# Vivado block design bd_f519, xcku15p-ffve1517-3-e, Vivado 2024.2
# (continued, part 3 of 3)
current_bd_instance /m05_nodes

# ---- hierarchy /m05_exit_pipeline ----
current_bd_instance /m05_exit_pipeline
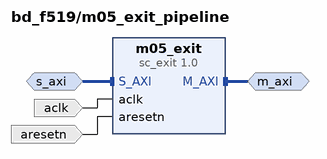
[diagram p17: block diagram inside /m05_exit_pipeline]
create_bd_intf_pin -mode Slave -vlnv xilinx.com:interface:aximm_rtl:1.0 s_axi
create_bd_intf_pin -mode Master -vlnv xilinx.com:interface:aximm_rtl:1.0 m_axi
create_bd_pin -dir I -type clk aclk
create_bd_pin -dir I -type rst aresetn

create_bd_cell -type ip -vlnv xilinx.com:ip:sc_exit:1.0 m05_exit
set_property -dict [list \
  CONFIG.ADDR_WIDTH 8 \
  CONFIG.ENABLE_PIPELINING 0 \
  CONFIG.HAS_BURST 0 \
  CONFIG.IS_CASCADED 0 \
  CONFIG.MEP_IDENTIFIER_WIDTH 1 \
  CONFIG.M_MAX_BURST_LENGTH 0 \
  CONFIG.M_PROTOCOL AXI4LITE \
  CONFIG.NUM_MSC 6 \
  CONFIG.NUM_READ_OUTSTANDING 8 \
  CONFIG.NUM_WRITE_OUTSTANDING 32 \
  CONFIG.RDATA_WIDTH 32 \
  CONFIG.READ_WRITE_MODE READ_WRITE \
  CONFIG.SINGLE_ISSUING 1 \
  CONFIG.SSC000_ROUTE 0b101 \
  CONFIG.SSC001_ROUTE 0b111 \
  CONFIG.SSC_ROUTE_WIDTH 3 \
  CONFIG.S_ID_WIDTH 1 \
  CONFIG.WDATA_WIDTH 32 \
] [get_bd_cells m05_exit]

# ---- connections ----

current_bd_instance /clk_map
connect_bd_net -net clk_map_aclk1_net [get_bd_pins aclk1] \
  [get_bd_pins M02_ACLK] [get_bd_pins psr0/slowest_sync_clk] [get_bd_pins psr_aclk1/slowest_sync_clk]
connect_bd_net -net clk_map_aclk2_net [get_bd_pins aclk2] \
  [get_bd_pins M03_ACLK] [get_bd_pins M04_ACLK] [get_bd_pins M05_ACLK] [get_bd_pins psr_aclk2/slowest_sync_clk]
connect_bd_net -net clk_map_aclk_net [get_bd_pins aclk] \
  [get_bd_pins S00_ACLK] [get_bd_pins M00_ACLK] [get_bd_pins M01_ACLK] [get_bd_pins swbd_aclk] \
  [get_bd_pins psr_aclk/slowest_sync_clk]
connect_bd_net -net clk_map_aresetn_net [get_bd_pins aresetn] \
  [get_bd_pins psr0/aux_reset_in] [get_bd_pins psr_aclk/aux_reset_in] [get_bd_pins psr_aclk1/aux_reset_in] \
  [get_bd_pins psr_aclk2/aux_reset_in]
connect_bd_net [get_bd_pins one/dout] [get_bd_pins psr0/ext_reset_in]
connect_bd_net [get_bd_pins psr0/interconnect_aresetn] \
  [get_bd_pins psr_aclk/ext_reset_in] [get_bd_pins psr_aclk1/ext_reset_in] [get_bd_pins psr_aclk2/ext_reset_in]
connect_bd_net [get_bd_pins psr_aclk1/interconnect_aresetn] [get_bd_pins M02_ARESETN]
connect_bd_net [get_bd_pins psr_aclk2/interconnect_aresetn] [get_bd_pins M03_ARESETN] [get_bd_pins M04_ARESETN] [get_bd_pins M05_ARESETN]
connect_bd_net [get_bd_pins psr_aclk/interconnect_aresetn] \
  [get_bd_pins S00_ARESETN] [get_bd_pins M00_ARESETN] [get_bd_pins M01_ARESETN] [get_bd_pins swbd_aresetn]

current_bd_instance /switchboards
connect_bd_intf_net [get_bd_intf_pins S00_SC_AR] [get_bd_intf_pins ar_la_in_swbd/S00_SC]
connect_bd_intf_net [get_bd_intf_pins S00_SC_AW] [get_bd_intf_pins aw_la_in_swbd/S00_SC]
connect_bd_intf_net [get_bd_intf_pins S00_SC_B] [get_bd_intf_pins b_la_out_swbd/S00_SC]
connect_bd_intf_net [get_bd_intf_pins S00_SC_R] [get_bd_intf_pins r_la_out_swbd/S00_SC]
connect_bd_intf_net [get_bd_intf_pins S00_SC_W] [get_bd_intf_pins w_la_in_swbd/S00_SC]
connect_bd_intf_net [get_bd_intf_pins S01_SC_B] [get_bd_intf_pins b_la_out_swbd/S01_SC]
connect_bd_intf_net [get_bd_intf_pins S01_SC_R] [get_bd_intf_pins r_la_out_swbd/S01_SC]
connect_bd_intf_net [get_bd_intf_pins S02_SC_B] [get_bd_intf_pins b_la_out_swbd/S02_SC]
connect_bd_intf_net [get_bd_intf_pins S02_SC_R] [get_bd_intf_pins r_la_out_swbd/S02_SC]
connect_bd_intf_net [get_bd_intf_pins S03_SC_B] [get_bd_intf_pins b_la_out_swbd/S03_SC]
connect_bd_intf_net [get_bd_intf_pins S03_SC_R] [get_bd_intf_pins r_la_out_swbd/S03_SC]
connect_bd_intf_net [get_bd_intf_pins S04_SC_B] [get_bd_intf_pins b_la_out_swbd/S04_SC]
connect_bd_intf_net [get_bd_intf_pins S04_SC_R] [get_bd_intf_pins r_la_out_swbd/S04_SC]
connect_bd_intf_net [get_bd_intf_pins S05_SC_B] [get_bd_intf_pins b_la_out_swbd/S05_SC]
connect_bd_intf_net [get_bd_intf_pins S05_SC_R] [get_bd_intf_pins r_la_out_swbd/S05_SC]
connect_bd_intf_net [get_bd_intf_pins ar_la_in_swbd/M00_SC] [get_bd_intf_pins i_nodes/S_SC_AR]
connect_bd_intf_net [get_bd_intf_pins M00_SC_AR] [get_bd_intf_pins ar_la_out_swbd/M00_SC]
connect_bd_intf_net [get_bd_intf_pins M01_SC_AR] [get_bd_intf_pins ar_la_out_swbd/M01_SC]
connect_bd_intf_net [get_bd_intf_pins M02_SC_AR] [get_bd_intf_pins ar_la_out_swbd/M02_SC]
connect_bd_intf_net [get_bd_intf_pins M03_SC_AR] [get_bd_intf_pins ar_la_out_swbd/M03_SC]
connect_bd_intf_net [get_bd_intf_pins M04_SC_AR] [get_bd_intf_pins ar_la_out_swbd/M04_SC]
connect_bd_intf_net [get_bd_intf_pins M05_SC_AR] [get_bd_intf_pins ar_la_out_swbd/M05_SC]
connect_bd_intf_net [get_bd_intf_pins aw_la_in_swbd/M00_SC] [get_bd_intf_pins i_nodes/S_SC_AW]
connect_bd_intf_net [get_bd_intf_pins M00_SC_AW] [get_bd_intf_pins aw_la_out_swbd/M00_SC]
connect_bd_intf_net [get_bd_intf_pins M01_SC_AW] [get_bd_intf_pins aw_la_out_swbd/M01_SC]
connect_bd_intf_net [get_bd_intf_pins M02_SC_AW] [get_bd_intf_pins aw_la_out_swbd/M02_SC]
connect_bd_intf_net [get_bd_intf_pins M03_SC_AW] [get_bd_intf_pins aw_la_out_swbd/M03_SC]
connect_bd_intf_net [get_bd_intf_pins M04_SC_AW] [get_bd_intf_pins aw_la_out_swbd/M04_SC]
connect_bd_intf_net [get_bd_intf_pins M05_SC_AW] [get_bd_intf_pins aw_la_out_swbd/M05_SC]
connect_bd_intf_net [get_bd_intf_pins M00_SC_B] [get_bd_intf_pins b_la_in_swbd/M00_SC]
connect_bd_intf_net [get_bd_intf_pins b_la_out_swbd/M00_SC] [get_bd_intf_pins i_nodes/S_SC_B]
connect_bd_intf_net [get_bd_intf_pins ar_la_out_swbd/S00_SC] [get_bd_intf_pins i_nodes/M_SC_AR]
connect_bd_intf_net [get_bd_intf_pins aw_la_out_swbd/S00_SC] [get_bd_intf_pins i_nodes/M_SC_AW]
connect_bd_intf_net [get_bd_intf_pins b_la_in_swbd/S00_SC] [get_bd_intf_pins i_nodes/M_SC_B]
connect_bd_intf_net [get_bd_intf_pins r_la_in_swbd/S00_SC] [get_bd_intf_pins i_nodes/M_SC_R]
connect_bd_intf_net [get_bd_intf_pins w_la_out_swbd/S00_SC] [get_bd_intf_pins i_nodes/M_SC_W]
connect_bd_intf_net [get_bd_intf_pins M00_SC_R] [get_bd_intf_pins r_la_in_swbd/M00_SC]
connect_bd_intf_net [get_bd_intf_pins r_la_out_swbd/M00_SC] [get_bd_intf_pins i_nodes/S_SC_R]
connect_bd_intf_net [get_bd_intf_pins w_la_in_swbd/M00_SC] [get_bd_intf_pins i_nodes/S_SC_W]
connect_bd_intf_net [get_bd_intf_pins M00_SC_W] [get_bd_intf_pins w_la_out_swbd/M00_SC]
connect_bd_intf_net [get_bd_intf_pins M01_SC_W] [get_bd_intf_pins w_la_out_swbd/M01_SC]
connect_bd_intf_net [get_bd_intf_pins M02_SC_W] [get_bd_intf_pins w_la_out_swbd/M02_SC]
connect_bd_intf_net [get_bd_intf_pins M03_SC_W] [get_bd_intf_pins w_la_out_swbd/M03_SC]
connect_bd_intf_net [get_bd_intf_pins M04_SC_W] [get_bd_intf_pins w_la_out_swbd/M04_SC]
connect_bd_intf_net [get_bd_intf_pins M05_SC_W] [get_bd_intf_pins w_la_out_swbd/M05_SC]
connect_bd_net [get_bd_pins m_sc_aclk] \
  [get_bd_pins i_nodes/m_sc_aclk] [get_bd_pins ar_la_out_swbd/aclk] [get_bd_pins aw_la_out_swbd/aclk] \
  [get_bd_pins b_la_out_swbd/aclk] [get_bd_pins r_la_out_swbd/aclk] [get_bd_pins w_la_out_swbd/aclk]
connect_bd_net [get_bd_pins m_sc_aresetn] [get_bd_pins i_nodes/m_sc_aresetn]
connect_bd_net [get_bd_pins s_sc_aclk] \
  [get_bd_pins i_nodes/s_sc_aclk] [get_bd_pins ar_la_in_swbd/aclk] [get_bd_pins aw_la_in_swbd/aclk] \
  [get_bd_pins b_la_in_swbd/aclk] [get_bd_pins r_la_in_swbd/aclk] [get_bd_pins w_la_in_swbd/aclk]
connect_bd_net [get_bd_pins s_sc_aresetn] [get_bd_pins i_nodes/s_sc_aresetn]

current_bd_instance /switchboards/i_nodes
connect_bd_intf_net [get_bd_intf_pins S_SC_AR] [get_bd_intf_pins i_ar_node/S_SC]
connect_bd_intf_net [get_bd_intf_pins S_SC_AW] [get_bd_intf_pins i_aw_node/S_SC]
connect_bd_intf_net [get_bd_intf_pins S_SC_B] [get_bd_intf_pins i_b_node/S_SC]
connect_bd_intf_net [get_bd_intf_pins S_SC_R] [get_bd_intf_pins i_r_node/S_SC]
connect_bd_intf_net [get_bd_intf_pins S_SC_W] [get_bd_intf_pins i_w_node/S_SC]
connect_bd_intf_net [get_bd_intf_pins M_SC_AR] [get_bd_intf_pins i_ar_node/M_SC]
connect_bd_intf_net [get_bd_intf_pins M_SC_AW] [get_bd_intf_pins i_aw_node/M_SC]
connect_bd_intf_net [get_bd_intf_pins M_SC_B] [get_bd_intf_pins i_b_node/M_SC]
connect_bd_intf_net [get_bd_intf_pins M_SC_R] [get_bd_intf_pins i_r_node/M_SC]
connect_bd_intf_net [get_bd_intf_pins M_SC_W] [get_bd_intf_pins i_w_node/M_SC]
connect_bd_net [get_bd_pins m_sc_aclk] \
  [get_bd_pins i_aw_node/m_sc_aclk] [get_bd_pins i_ar_node/m_sc_aclk] [get_bd_pins i_w_node/m_sc_aclk] \
  [get_bd_pins i_r_node/s_sc_aclk] [get_bd_pins i_b_node/s_sc_aclk]
connect_bd_net [get_bd_pins m_sc_aresetn] \
  [get_bd_pins i_aw_node/m_sc_aresetn] [get_bd_pins i_ar_node/m_sc_aresetn] [get_bd_pins i_w_node/m_sc_aresetn] \
  [get_bd_pins i_r_node/s_sc_aresetn] [get_bd_pins i_b_node/s_sc_aresetn]
connect_bd_net [get_bd_pins s_sc_aclk] \
  [get_bd_pins i_aw_node/s_sc_aclk] [get_bd_pins i_w_node/s_sc_aclk] [get_bd_pins i_ar_node/s_sc_aclk] \
  [get_bd_pins i_r_node/m_sc_aclk] [get_bd_pins i_b_node/m_sc_aclk]
connect_bd_net [get_bd_pins s_sc_aresetn] \
  [get_bd_pins i_aw_node/s_sc_aresetn] [get_bd_pins i_w_node/s_sc_aresetn] [get_bd_pins i_ar_node/s_sc_aresetn] \
  [get_bd_pins i_r_node/m_sc_aresetn] [get_bd_pins i_b_node/m_sc_aresetn]

current_bd_instance /s00_entry_pipeline
connect_bd_intf_net [get_bd_intf_pins s00_mmu/M_AXI] [get_bd_intf_pins s00_transaction_regulator/S_AXI]
connect_bd_intf_net [get_bd_intf_pins m_axi] [get_bd_intf_pins s00_si_converter/M_AXI]
connect_bd_intf_net [get_bd_intf_pins s00_transaction_regulator/M_AXI] [get_bd_intf_pins s00_si_converter/S_AXI]
connect_bd_intf_net [get_bd_intf_pins s_axi] [get_bd_intf_pins s00_mmu/S_AXI]
connect_bd_net [get_bd_pins aclk] [get_bd_pins s00_mmu/aclk] [get_bd_pins s00_si_converter/aclk] [get_bd_pins s00_transaction_regulator/aclk]
connect_bd_net [get_bd_pins aresetn] \
  [get_bd_pins s00_mmu/aresetn] [get_bd_pins s00_si_converter/aresetn] [get_bd_pins s00_transaction_regulator/aresetn]

current_bd_instance /s00_nodes
connect_bd_intf_net [get_bd_intf_pins S_SC_AR] [get_bd_intf_pins s00_ar_node/S_SC]
connect_bd_intf_net [get_bd_intf_pins S_SC_AW] [get_bd_intf_pins s00_aw_node/S_SC]
connect_bd_intf_net [get_bd_intf_pins S_SC_B] [get_bd_intf_pins s00_b_node/S_SC]
connect_bd_intf_net [get_bd_intf_pins S_SC_R] [get_bd_intf_pins s00_r_node/S_SC]
connect_bd_intf_net [get_bd_intf_pins S_SC_W] [get_bd_intf_pins s00_w_node/S_SC]
connect_bd_intf_net [get_bd_intf_pins M_SC_AR] [get_bd_intf_pins s00_ar_node/M_SC]
connect_bd_intf_net [get_bd_intf_pins M_SC_AW] [get_bd_intf_pins s00_aw_node/M_SC]
connect_bd_intf_net [get_bd_intf_pins M_SC_B] [get_bd_intf_pins s00_b_node/M_SC]
connect_bd_intf_net [get_bd_intf_pins M_SC_R] [get_bd_intf_pins s00_r_node/M_SC]
connect_bd_intf_net [get_bd_intf_pins M_SC_W] [get_bd_intf_pins s00_w_node/M_SC]
connect_bd_net [get_bd_pins m_sc_clk] \
  [get_bd_pins s00_ar_node/m_sc_aclk] [get_bd_pins s00_aw_node/m_sc_aclk] [get_bd_pins s00_w_node/m_sc_aclk] \
  [get_bd_pins s00_r_node/s_sc_aclk] [get_bd_pins s00_b_node/s_sc_aclk]
connect_bd_net [get_bd_pins m_sc_resetn] \
  [get_bd_pins s00_ar_node/m_sc_aresetn] [get_bd_pins s00_aw_node/m_sc_aresetn] [get_bd_pins s00_w_node/m_sc_aresetn] \
  [get_bd_pins s00_r_node/s_sc_aresetn] [get_bd_pins s00_b_node/s_sc_aresetn]
connect_bd_net [get_bd_pins s_sc_clk] \
  [get_bd_pins s00_ar_node/s_sc_aclk] [get_bd_pins s00_aw_node/s_sc_aclk] [get_bd_pins s00_w_node/s_sc_aclk] \
  [get_bd_pins s00_r_node/m_sc_aclk] [get_bd_pins s00_b_node/m_sc_aclk]
connect_bd_net [get_bd_pins s_sc_resetn] \
  [get_bd_pins s00_ar_node/s_sc_aresetn] [get_bd_pins s00_aw_node/s_sc_aresetn] [get_bd_pins s00_w_node/s_sc_aresetn] \
  [get_bd_pins s00_r_node/m_sc_aresetn] [get_bd_pins s00_b_node/m_sc_aresetn]

current_bd_instance /m00_nodes
connect_bd_intf_net [get_bd_intf_pins S_SC_AR] [get_bd_intf_pins m00_ar_node/S_SC]
connect_bd_intf_net [get_bd_intf_pins S_SC_AW] [get_bd_intf_pins m00_aw_node/S_SC]
connect_bd_intf_net [get_bd_intf_pins S_SC_B] [get_bd_intf_pins m00_b_node/S_SC]
connect_bd_intf_net [get_bd_intf_pins S_SC_R] [get_bd_intf_pins m00_r_node/S_SC]
connect_bd_intf_net [get_bd_intf_pins S_SC_W] [get_bd_intf_pins m00_w_node/S_SC]
connect_bd_intf_net [get_bd_intf_pins M_SC_AR] [get_bd_intf_pins m00_ar_node/M_SC]
connect_bd_intf_net [get_bd_intf_pins M_SC_AW] [get_bd_intf_pins m00_aw_node/M_SC]
connect_bd_intf_net [get_bd_intf_pins M_SC_B] [get_bd_intf_pins m00_b_node/M_SC]
connect_bd_intf_net [get_bd_intf_pins M_SC_R] [get_bd_intf_pins m00_r_node/M_SC]
connect_bd_intf_net [get_bd_intf_pins M_SC_W] [get_bd_intf_pins m00_w_node/M_SC]
connect_bd_net [get_bd_pins m_axi_aclk] \
  [get_bd_pins m00_ar_node/m_sc_aclk] [get_bd_pins m00_aw_node/m_sc_aclk] [get_bd_pins m00_w_node/m_sc_aclk] \
  [get_bd_pins m00_r_node/s_sc_aclk] [get_bd_pins m00_b_node/s_sc_aclk]
connect_bd_net [get_bd_pins m_axi_aresetn] \
  [get_bd_pins m00_ar_node/m_sc_aresetn] [get_bd_pins m00_aw_node/m_sc_aresetn] [get_bd_pins m00_w_node/m_sc_aresetn] \
  [get_bd_pins m00_r_node/s_sc_aresetn] [get_bd_pins m00_b_node/s_sc_aresetn]
connect_bd_net [get_bd_pins s_axi_aclk] \
  [get_bd_pins m00_ar_node/s_sc_aclk] [get_bd_pins m00_aw_node/s_sc_aclk] [get_bd_pins m00_w_node/s_sc_aclk] \
  [get_bd_pins m00_r_node/m_sc_aclk] [get_bd_pins m00_b_node/m_sc_aclk]
connect_bd_net [get_bd_pins s_axi_aresetn] \
  [get_bd_pins m00_ar_node/s_sc_aresetn] [get_bd_pins m00_aw_node/s_sc_aresetn] [get_bd_pins m00_w_node/s_sc_aresetn] \
  [get_bd_pins m00_r_node/m_sc_aresetn] [get_bd_pins m00_b_node/m_sc_aresetn]

current_bd_instance /m00_exit_pipeline
connect_bd_intf_net [get_bd_intf_pins m_axi] [get_bd_intf_pins m00_exit/M_AXI]
connect_bd_intf_net [get_bd_intf_pins s_axi] [get_bd_intf_pins m00_exit/S_AXI]
connect_bd_net [get_bd_pins aclk] [get_bd_pins m00_exit/aclk]
connect_bd_net [get_bd_pins aresetn] [get_bd_pins m00_exit/aresetn]

current_bd_instance /m01_nodes
connect_bd_intf_net [get_bd_intf_pins S_SC_AR] [get_bd_intf_pins m01_ar_node/S_SC]
connect_bd_intf_net [get_bd_intf_pins S_SC_AW] [get_bd_intf_pins m01_aw_node/S_SC]
connect_bd_intf_net [get_bd_intf_pins S_SC_B] [get_bd_intf_pins m01_b_node/S_SC]
connect_bd_intf_net [get_bd_intf_pins S_SC_R] [get_bd_intf_pins m01_r_node/S_SC]
connect_bd_intf_net [get_bd_intf_pins S_SC_W] [get_bd_intf_pins m01_w_node/S_SC]
connect_bd_intf_net [get_bd_intf_pins M_SC_AR] [get_bd_intf_pins m01_ar_node/M_SC]
connect_bd_intf_net [get_bd_intf_pins M_SC_AW] [get_bd_intf_pins m01_aw_node/M_SC]
connect_bd_intf_net [get_bd_intf_pins M_SC_B] [get_bd_intf_pins m01_b_node/M_SC]
connect_bd_intf_net [get_bd_intf_pins M_SC_R] [get_bd_intf_pins m01_r_node/M_SC]
connect_bd_intf_net [get_bd_intf_pins M_SC_W] [get_bd_intf_pins m01_w_node/M_SC]
connect_bd_net [get_bd_pins m_axi_aclk] \
  [get_bd_pins m01_ar_node/m_sc_aclk] [get_bd_pins m01_aw_node/m_sc_aclk] [get_bd_pins m01_w_node/m_sc_aclk] \
  [get_bd_pins m01_r_node/s_sc_aclk] [get_bd_pins m01_b_node/s_sc_aclk]
connect_bd_net [get_bd_pins m_axi_aresetn] \
  [get_bd_pins m01_ar_node/m_sc_aresetn] [get_bd_pins m01_aw_node/m_sc_aresetn] [get_bd_pins m01_w_node/m_sc_aresetn] \
  [get_bd_pins m01_r_node/s_sc_aresetn] [get_bd_pins m01_b_node/s_sc_aresetn]
connect_bd_net [get_bd_pins s_axi_aclk] \
  [get_bd_pins m01_ar_node/s_sc_aclk] [get_bd_pins m01_aw_node/s_sc_aclk] [get_bd_pins m01_w_node/s_sc_aclk] \
  [get_bd_pins m01_r_node/m_sc_aclk] [get_bd_pins m01_b_node/m_sc_aclk]
connect_bd_net [get_bd_pins s_axi_aresetn] \
  [get_bd_pins m01_ar_node/s_sc_aresetn] [get_bd_pins m01_aw_node/s_sc_aresetn] [get_bd_pins m01_w_node/s_sc_aresetn] \
  [get_bd_pins m01_r_node/m_sc_aresetn] [get_bd_pins m01_b_node/m_sc_aresetn]

current_bd_instance /m01_exit_pipeline
connect_bd_intf_net [get_bd_intf_pins m_axi] [get_bd_intf_pins m01_exit/M_AXI]
connect_bd_intf_net [get_bd_intf_pins s_axi] [get_bd_intf_pins m01_exit/S_AXI]
connect_bd_net [get_bd_pins aclk] [get_bd_pins m01_exit/aclk]
connect_bd_net [get_bd_pins aresetn] [get_bd_pins m01_exit/aresetn]

current_bd_instance /m02_nodes
connect_bd_intf_net [get_bd_intf_pins S_SC_AR] [get_bd_intf_pins m02_ar_node/S_SC]
connect_bd_intf_net [get_bd_intf_pins S_SC_AW] [get_bd_intf_pins m02_aw_node/S_SC]
connect_bd_intf_net [get_bd_intf_pins S_SC_B] [get_bd_intf_pins m02_b_node/S_SC]
connect_bd_intf_net [get_bd_intf_pins S_SC_R] [get_bd_intf_pins m02_r_node/S_SC]
connect_bd_intf_net [get_bd_intf_pins S_SC_W] [get_bd_intf_pins m02_w_node/S_SC]
connect_bd_intf_net [get_bd_intf_pins M_SC_AR] [get_bd_intf_pins m02_ar_node/M_SC]
connect_bd_intf_net [get_bd_intf_pins M_SC_AW] [get_bd_intf_pins m02_aw_node/M_SC]
connect_bd_intf_net [get_bd_intf_pins M_SC_B] [get_bd_intf_pins m02_b_node/M_SC]
connect_bd_intf_net [get_bd_intf_pins M_SC_R] [get_bd_intf_pins m02_r_node/M_SC]
connect_bd_intf_net [get_bd_intf_pins M_SC_W] [get_bd_intf_pins m02_w_node/M_SC]
connect_bd_net [get_bd_pins m_axi_aclk] \
  [get_bd_pins m02_ar_node/m_sc_aclk] [get_bd_pins m02_aw_node/m_sc_aclk] [get_bd_pins m02_w_node/m_sc_aclk] \
  [get_bd_pins m02_r_node/s_sc_aclk] [get_bd_pins m02_b_node/s_sc_aclk]
connect_bd_net [get_bd_pins m_axi_aresetn] \
  [get_bd_pins m02_ar_node/m_sc_aresetn] [get_bd_pins m02_aw_node/m_sc_aresetn] [get_bd_pins m02_w_node/m_sc_aresetn] \
  [get_bd_pins m02_r_node/s_sc_aresetn] [get_bd_pins m02_b_node/s_sc_aresetn]
connect_bd_net [get_bd_pins s_axi_aclk] \
  [get_bd_pins m02_ar_node/s_sc_aclk] [get_bd_pins m02_aw_node/s_sc_aclk] [get_bd_pins m02_w_node/s_sc_aclk] \
  [get_bd_pins m02_r_node/m_sc_aclk] [get_bd_pins m02_b_node/m_sc_aclk]
connect_bd_net [get_bd_pins s_axi_aresetn] \
  [get_bd_pins m02_ar_node/s_sc_aresetn] [get_bd_pins m02_aw_node/s_sc_aresetn] [get_bd_pins m02_w_node/s_sc_aresetn] \
  [get_bd_pins m02_r_node/m_sc_aresetn] [get_bd_pins m02_b_node/m_sc_aresetn]

current_bd_instance /m02_exit_pipeline
connect_bd_intf_net [get_bd_intf_pins m_axi] [get_bd_intf_pins m02_exit/M_AXI]
connect_bd_intf_net [get_bd_intf_pins s_axi] [get_bd_intf_pins m02_exit/S_AXI]
connect_bd_net [get_bd_pins aclk] [get_bd_pins m02_exit/aclk]
connect_bd_net [get_bd_pins aresetn] [get_bd_pins m02_exit/aresetn]

current_bd_instance /m03_nodes
connect_bd_intf_net [get_bd_intf_pins S_SC_AR] [get_bd_intf_pins m03_ar_node/S_SC]
connect_bd_intf_net [get_bd_intf_pins S_SC_AW] [get_bd_intf_pins m03_aw_node/S_SC]
connect_bd_intf_net [get_bd_intf_pins S_SC_B] [get_bd_intf_pins m03_b_node/S_SC]
connect_bd_intf_net [get_bd_intf_pins S_SC_R] [get_bd_intf_pins m03_r_node/S_SC]
connect_bd_intf_net [get_bd_intf_pins S_SC_W] [get_bd_intf_pins m03_w_node/S_SC]
connect_bd_intf_net [get_bd_intf_pins M_SC_AR] [get_bd_intf_pins m03_ar_node/M_SC]
connect_bd_intf_net [get_bd_intf_pins M_SC_AW] [get_bd_intf_pins m03_aw_node/M_SC]
connect_bd_intf_net [get_bd_intf_pins M_SC_B] [get_bd_intf_pins m03_b_node/M_SC]
connect_bd_intf_net [get_bd_intf_pins M_SC_R] [get_bd_intf_pins m03_r_node/M_SC]
connect_bd_intf_net [get_bd_intf_pins M_SC_W] [get_bd_intf_pins m03_w_node/M_SC]
connect_bd_net [get_bd_pins m_axi_aclk] \
  [get_bd_pins m03_ar_node/m_sc_aclk] [get_bd_pins m03_aw_node/m_sc_aclk] [get_bd_pins m03_w_node/m_sc_aclk] \
  [get_bd_pins m03_r_node/s_sc_aclk] [get_bd_pins m03_b_node/s_sc_aclk]
connect_bd_net [get_bd_pins m_axi_aresetn] \
  [get_bd_pins m03_ar_node/m_sc_aresetn] [get_bd_pins m03_aw_node/m_sc_aresetn] [get_bd_pins m03_w_node/m_sc_aresetn] \
  [get_bd_pins m03_r_node/s_sc_aresetn] [get_bd_pins m03_b_node/s_sc_aresetn]
connect_bd_net [get_bd_pins s_axi_aclk] \
  [get_bd_pins m03_ar_node/s_sc_aclk] [get_bd_pins m03_aw_node/s_sc_aclk] [get_bd_pins m03_w_node/s_sc_aclk] \
  [get_bd_pins m03_r_node/m_sc_aclk] [get_bd_pins m03_b_node/m_sc_aclk]
connect_bd_net [get_bd_pins s_axi_aresetn] \
  [get_bd_pins m03_ar_node/s_sc_aresetn] [get_bd_pins m03_aw_node/s_sc_aresetn] [get_bd_pins m03_w_node/s_sc_aresetn] \
  [get_bd_pins m03_r_node/m_sc_aresetn] [get_bd_pins m03_b_node/m_sc_aresetn]

current_bd_instance /m03_exit_pipeline
connect_bd_intf_net [get_bd_intf_pins m_axi] [get_bd_intf_pins m03_exit/M_AXI]
connect_bd_intf_net [get_bd_intf_pins s_axi] [get_bd_intf_pins m03_exit/S_AXI]
connect_bd_net [get_bd_pins aclk] [get_bd_pins m03_exit/aclk]
connect_bd_net [get_bd_pins aresetn] [get_bd_pins m03_exit/aresetn]

current_bd_instance /m04_nodes
connect_bd_intf_net [get_bd_intf_pins S_SC_AR] [get_bd_intf_pins m04_ar_node/S_SC]
connect_bd_intf_net [get_bd_intf_pins S_SC_AW] [get_bd_intf_pins m04_aw_node/S_SC]
connect_bd_intf_net [get_bd_intf_pins S_SC_B] [get_bd_intf_pins m04_b_node/S_SC]
connect_bd_intf_net [get_bd_intf_pins S_SC_R] [get_bd_intf_pins m04_r_node/S_SC]
connect_bd_intf_net [get_bd_intf_pins S_SC_W] [get_bd_intf_pins m04_w_node/S_SC]
connect_bd_intf_net [get_bd_intf_pins M_SC_AR] [get_bd_intf_pins m04_ar_node/M_SC]
connect_bd_intf_net [get_bd_intf_pins M_SC_AW] [get_bd_intf_pins m04_aw_node/M_SC]
connect_bd_intf_net [get_bd_intf_pins M_SC_B] [get_bd_intf_pins m04_b_node/M_SC]
connect_bd_intf_net [get_bd_intf_pins M_SC_R] [get_bd_intf_pins m04_r_node/M_SC]
connect_bd_intf_net [get_bd_intf_pins M_SC_W] [get_bd_intf_pins m04_w_node/M_SC]
connect_bd_net [get_bd_pins m_axi_aclk] \
  [get_bd_pins m04_ar_node/m_sc_aclk] [get_bd_pins m04_aw_node/m_sc_aclk] [get_bd_pins m04_w_node/m_sc_aclk] \
  [get_bd_pins m04_r_node/s_sc_aclk] [get_bd_pins m04_b_node/s_sc_aclk]
connect_bd_net [get_bd_pins m_axi_aresetn] \
  [get_bd_pins m04_ar_node/m_sc_aresetn] [get_bd_pins m04_aw_node/m_sc_aresetn] [get_bd_pins m04_w_node/m_sc_aresetn] \
  [get_bd_pins m04_r_node/s_sc_aresetn] [get_bd_pins m04_b_node/s_sc_aresetn]
connect_bd_net [get_bd_pins s_axi_aclk] \
  [get_bd_pins m04_ar_node/s_sc_aclk] [get_bd_pins m04_aw_node/s_sc_aclk] [get_bd_pins m04_w_node/s_sc_aclk] \
  [get_bd_pins m04_r_node/m_sc_aclk] [get_bd_pins m04_b_node/m_sc_aclk]
connect_bd_net [get_bd_pins s_axi_aresetn] \
  [get_bd_pins m04_ar_node/s_sc_aresetn] [get_bd_pins m04_aw_node/s_sc_aresetn] [get_bd_pins m04_w_node/s_sc_aresetn] \
  [get_bd_pins m04_r_node/m_sc_aresetn] [get_bd_pins m04_b_node/m_sc_aresetn]

current_bd_instance /m04_exit_pipeline
connect_bd_intf_net [get_bd_intf_pins m_axi] [get_bd_intf_pins m04_exit/M_AXI]
connect_bd_intf_net [get_bd_intf_pins s_axi] [get_bd_intf_pins m04_exit/S_AXI]
connect_bd_net [get_bd_pins aclk] [get_bd_pins m04_exit/aclk]
connect_bd_net [get_bd_pins aresetn] [get_bd_pins m04_exit/aresetn]

current_bd_instance /m05_nodes
connect_bd_intf_net [get_bd_intf_pins S_SC_AR] [get_bd_intf_pins m05_ar_node/S_SC]
connect_bd_intf_net [get_bd_intf_pins S_SC_AW] [get_bd_intf_pins m05_aw_node/S_SC]
connect_bd_intf_net [get_bd_intf_pins S_SC_B] [get_bd_intf_pins m05_b_node/S_SC]
connect_bd_intf_net [get_bd_intf_pins S_SC_R] [get_bd_intf_pins m05_r_node/S_SC]
connect_bd_intf_net [get_bd_intf_pins S_SC_W] [get_bd_intf_pins m05_w_node/S_SC]
connect_bd_intf_net [get_bd_intf_pins M_SC_AR] [get_bd_intf_pins m05_ar_node/M_SC]
connect_bd_intf_net [get_bd_intf_pins M_SC_AW] [get_bd_intf_pins m05_aw_node/M_SC]
connect_bd_intf_net [get_bd_intf_pins M_SC_B] [get_bd_intf_pins m05_b_node/M_SC]
connect_bd_intf_net [get_bd_intf_pins M_SC_R] [get_bd_intf_pins m05_r_node/M_SC]
connect_bd_intf_net [get_bd_intf_pins M_SC_W] [get_bd_intf_pins m05_w_node/M_SC]
connect_bd_net [get_bd_pins m_axi_aclk] \
  [get_bd_pins m05_ar_node/m_sc_aclk] [get_bd_pins m05_aw_node/m_sc_aclk] [get_bd_pins m05_w_node/m_sc_aclk] \
  [get_bd_pins m05_r_node/s_sc_aclk] [get_bd_pins m05_b_node/s_sc_aclk]
connect_bd_net [get_bd_pins m_axi_aresetn] \
  [get_bd_pins m05_ar_node/m_sc_aresetn] [get_bd_pins m05_aw_node/m_sc_aresetn] [get_bd_pins m05_w_node/m_sc_aresetn] \
  [get_bd_pins m05_r_node/s_sc_aresetn] [get_bd_pins m05_b_node/s_sc_aresetn]
connect_bd_net [get_bd_pins s_axi_aclk] \
  [get_bd_pins m05_ar_node/s_sc_aclk] [get_bd_pins m05_aw_node/s_sc_aclk] [get_bd_pins m05_w_node/s_sc_aclk] \
  [get_bd_pins m05_r_node/m_sc_aclk] [get_bd_pins m05_b_node/m_sc_aclk]
connect_bd_net [get_bd_pins s_axi_aresetn] \
  [get_bd_pins m05_ar_node/s_sc_aresetn] [get_bd_pins m05_aw_node/s_sc_aresetn] [get_bd_pins m05_w_node/s_sc_aresetn] \
  [get_bd_pins m05_r_node/m_sc_aresetn] [get_bd_pins m05_b_node/m_sc_aresetn]

current_bd_instance /m05_exit_pipeline
connect_bd_intf_net [get_bd_intf_pins m_axi] [get_bd_intf_pins m05_exit/M_AXI]
connect_bd_intf_net [get_bd_intf_pins s_axi] [get_bd_intf_pins m05_exit/S_AXI]
connect_bd_net [get_bd_pins aclk] [get_bd_pins m05_exit/aclk]
connect_bd_net [get_bd_pins aresetn] [get_bd_pins m05_exit/aresetn]

current_bd_instance /
connect_bd_intf_net [get_bd_intf_ports S00_AXI] [get_bd_intf_pins s00_entry_pipeline/s_axi]
connect_bd_intf_net [get_bd_intf_pins s00_nodes/S_SC_AR] [get_bd_intf_pins s00_axi2sc/M_SC_AR]
connect_bd_intf_net [get_bd_intf_pins m00_nodes/S_SC_AR] [get_bd_intf_pins switchboards/M00_SC_AR]
connect_bd_intf_net [get_bd_intf_pins m01_nodes/S_SC_AR] [get_bd_intf_pins switchboards/M01_SC_AR]
connect_bd_intf_net [get_bd_intf_pins m02_nodes/S_SC_AR] [get_bd_intf_pins switchboards/M02_SC_AR]
connect_bd_intf_net [get_bd_intf_pins m03_nodes/S_SC_AR] [get_bd_intf_pins switchboards/M03_SC_AR]
connect_bd_intf_net [get_bd_intf_pins m04_nodes/S_SC_AR] [get_bd_intf_pins switchboards/M04_SC_AR]
connect_bd_intf_net [get_bd_intf_pins m05_nodes/S_SC_AR] [get_bd_intf_pins switchboards/M05_SC_AR]
connect_bd_intf_net [get_bd_intf_pins s00_nodes/S_SC_AW] [get_bd_intf_pins s00_axi2sc/M_SC_AW]
connect_bd_intf_net [get_bd_intf_pins m00_nodes/S_SC_AW] [get_bd_intf_pins switchboards/M00_SC_AW]
connect_bd_intf_net [get_bd_intf_pins m01_nodes/S_SC_AW] [get_bd_intf_pins switchboards/M01_SC_AW]
connect_bd_intf_net [get_bd_intf_pins m02_nodes/S_SC_AW] [get_bd_intf_pins switchboards/M02_SC_AW]
connect_bd_intf_net [get_bd_intf_pins m03_nodes/S_SC_AW] [get_bd_intf_pins switchboards/M03_SC_AW]
connect_bd_intf_net [get_bd_intf_pins m04_nodes/S_SC_AW] [get_bd_intf_pins switchboards/M04_SC_AW]
connect_bd_intf_net [get_bd_intf_pins m05_nodes/S_SC_AW] [get_bd_intf_pins switchboards/M05_SC_AW]
connect_bd_intf_net [get_bd_intf_pins s00_nodes/S_SC_B] [get_bd_intf_pins switchboards/M00_SC_B]
connect_bd_intf_net [get_bd_intf_pins m00_nodes/S_SC_B] [get_bd_intf_pins m00_sc2axi/M_SC_B]
connect_bd_intf_net [get_bd_intf_pins m01_nodes/S_SC_B] [get_bd_intf_pins m01_sc2axi/M_SC_B]
connect_bd_intf_net [get_bd_intf_pins m02_nodes/S_SC_B] [get_bd_intf_pins m02_sc2axi/M_SC_B]
connect_bd_intf_net [get_bd_intf_pins m03_nodes/S_SC_B] [get_bd_intf_pins m03_sc2axi/M_SC_B]
connect_bd_intf_net [get_bd_intf_pins m04_nodes/S_SC_B] [get_bd_intf_pins m04_sc2axi/M_SC_B]
connect_bd_intf_net [get_bd_intf_pins m05_nodes/S_SC_B] [get_bd_intf_pins m05_sc2axi/M_SC_B]
connect_bd_intf_net [get_bd_intf_pins s00_nodes/S_SC_R] [get_bd_intf_pins switchboards/M00_SC_R]
connect_bd_intf_net [get_bd_intf_pins m00_nodes/S_SC_R] [get_bd_intf_pins m00_sc2axi/M_SC_R]
connect_bd_intf_net [get_bd_intf_pins m01_nodes/S_SC_R] [get_bd_intf_pins m01_sc2axi/M_SC_R]
connect_bd_intf_net [get_bd_intf_pins m02_nodes/S_SC_R] [get_bd_intf_pins m02_sc2axi/M_SC_R]
connect_bd_intf_net [get_bd_intf_pins m03_nodes/S_SC_R] [get_bd_intf_pins m03_sc2axi/M_SC_R]
connect_bd_intf_net [get_bd_intf_pins m04_nodes/S_SC_R] [get_bd_intf_pins m04_sc2axi/M_SC_R]
connect_bd_intf_net [get_bd_intf_pins m05_nodes/S_SC_R] [get_bd_intf_pins m05_sc2axi/M_SC_R]
connect_bd_intf_net [get_bd_intf_pins s00_nodes/S_SC_W] [get_bd_intf_pins s00_axi2sc/M_SC_W]
connect_bd_intf_net [get_bd_intf_pins m00_nodes/S_SC_W] [get_bd_intf_pins switchboards/M00_SC_W]
connect_bd_intf_net [get_bd_intf_pins m01_nodes/S_SC_W] [get_bd_intf_pins switchboards/M01_SC_W]
connect_bd_intf_net [get_bd_intf_pins m02_nodes/S_SC_W] [get_bd_intf_pins switchboards/M02_SC_W]
connect_bd_intf_net [get_bd_intf_pins m03_nodes/S_SC_W] [get_bd_intf_pins switchboards/M03_SC_W]
connect_bd_intf_net [get_bd_intf_pins m04_nodes/S_SC_W] [get_bd_intf_pins switchboards/M04_SC_W]
connect_bd_intf_net [get_bd_intf_pins m05_nodes/S_SC_W] [get_bd_intf_pins switchboards/M05_SC_W]
connect_bd_intf_net [get_bd_intf_ports M00_AXI] [get_bd_intf_pins m00_exit_pipeline/m_axi]
connect_bd_intf_net [get_bd_intf_pins m00_nodes/M_SC_AR] [get_bd_intf_pins m00_sc2axi/S_SC_AR]
connect_bd_intf_net [get_bd_intf_pins m00_nodes/M_SC_AW] [get_bd_intf_pins m00_sc2axi/S_SC_AW]
connect_bd_intf_net [get_bd_intf_pins m00_nodes/M_SC_B] [get_bd_intf_pins switchboards/S00_SC_B]
connect_bd_intf_net [get_bd_intf_pins m00_nodes/M_SC_R] [get_bd_intf_pins switchboards/S00_SC_R]
connect_bd_intf_net [get_bd_intf_pins m00_nodes/M_SC_W] [get_bd_intf_pins m00_sc2axi/S_SC_W]
connect_bd_intf_net [get_bd_intf_pins m00_sc2axi/M_AXI] [get_bd_intf_pins m00_exit_pipeline/s_axi]
connect_bd_intf_net [get_bd_intf_ports M01_AXI] [get_bd_intf_pins m01_exit_pipeline/m_axi]
connect_bd_intf_net [get_bd_intf_pins m01_nodes/M_SC_AR] [get_bd_intf_pins m01_sc2axi/S_SC_AR]
connect_bd_intf_net [get_bd_intf_pins m01_nodes/M_SC_AW] [get_bd_intf_pins m01_sc2axi/S_SC_AW]
connect_bd_intf_net [get_bd_intf_pins m01_nodes/M_SC_B] [get_bd_intf_pins switchboards/S01_SC_B]
connect_bd_intf_net [get_bd_intf_pins m01_nodes/M_SC_R] [get_bd_intf_pins switchboards/S01_SC_R]
connect_bd_intf_net [get_bd_intf_pins m01_nodes/M_SC_W] [get_bd_intf_pins m01_sc2axi/S_SC_W]
connect_bd_intf_net [get_bd_intf_pins m01_sc2axi/M_AXI] [get_bd_intf_pins m01_exit_pipeline/s_axi]
connect_bd_intf_net [get_bd_intf_ports M02_AXI] [get_bd_intf_pins m02_exit_pipeline/m_axi]
connect_bd_intf_net [get_bd_intf_pins m02_nodes/M_SC_AR] [get_bd_intf_pins m02_sc2axi/S_SC_AR]
connect_bd_intf_net [get_bd_intf_pins m02_nodes/M_SC_AW] [get_bd_intf_pins m02_sc2axi/S_SC_AW]
connect_bd_intf_net [get_bd_intf_pins m02_nodes/M_SC_B] [get_bd_intf_pins switchboards/S02_SC_B]
connect_bd_intf_net [get_bd_intf_pins m02_nodes/M_SC_R] [get_bd_intf_pins switchboards/S02_SC_R]
connect_bd_intf_net [get_bd_intf_pins m02_nodes/M_SC_W] [get_bd_intf_pins m02_sc2axi/S_SC_W]
connect_bd_intf_net [get_bd_intf_pins m02_sc2axi/M_AXI] [get_bd_intf_pins m02_exit_pipeline/s_axi]
connect_bd_intf_net [get_bd_intf_ports M03_AXI] [get_bd_intf_pins m03_exit_pipeline/m_axi]
connect_bd_intf_net [get_bd_intf_pins m03_nodes/M_SC_AR] [get_bd_intf_pins m03_sc2axi/S_SC_AR]
connect_bd_intf_net [get_bd_intf_pins m03_nodes/M_SC_AW] [get_bd_intf_pins m03_sc2axi/S_SC_AW]
connect_bd_intf_net [get_bd_intf_pins m03_nodes/M_SC_B] [get_bd_intf_pins switchboards/S03_SC_B]
connect_bd_intf_net [get_bd_intf_pins m03_nodes/M_SC_R] [get_bd_intf_pins switchboards/S03_SC_R]
connect_bd_intf_net [get_bd_intf_pins m03_nodes/M_SC_W] [get_bd_intf_pins m03_sc2axi/S_SC_W]
connect_bd_intf_net [get_bd_intf_pins m03_sc2axi/M_AXI] [get_bd_intf_pins m03_exit_pipeline/s_axi]
connect_bd_intf_net [get_bd_intf_ports M04_AXI] [get_bd_intf_pins m04_exit_pipeline/m_axi]
connect_bd_intf_net [get_bd_intf_pins m04_nodes/M_SC_AR] [get_bd_intf_pins m04_sc2axi/S_SC_AR]
connect_bd_intf_net [get_bd_intf_pins m04_nodes/M_SC_AW] [get_bd_intf_pins m04_sc2axi/S_SC_AW]
connect_bd_intf_net [get_bd_intf_pins m04_nodes/M_SC_B] [get_bd_intf_pins switchboards/S04_SC_B]
connect_bd_intf_net [get_bd_intf_pins m04_nodes/M_SC_R] [get_bd_intf_pins switchboards/S04_SC_R]
connect_bd_intf_net [get_bd_intf_pins m04_nodes/M_SC_W] [get_bd_intf_pins m04_sc2axi/S_SC_W]
connect_bd_intf_net [get_bd_intf_pins m04_sc2axi/M_AXI] [get_bd_intf_pins m04_exit_pipeline/s_axi]
connect_bd_intf_net [get_bd_intf_ports M05_AXI] [get_bd_intf_pins m05_exit_pipeline/m_axi]
connect_bd_intf_net [get_bd_intf_pins m05_nodes/M_SC_AR] [get_bd_intf_pins m05_sc2axi/S_SC_AR]
connect_bd_intf_net [get_bd_intf_pins m05_nodes/M_SC_AW] [get_bd_intf_pins m05_sc2axi/S_SC_AW]
connect_bd_intf_net [get_bd_intf_pins m05_nodes/M_SC_B] [get_bd_intf_pins switchboards/S05_SC_B]
connect_bd_intf_net [get_bd_intf_pins m05_nodes/M_SC_R] [get_bd_intf_pins switchboards/S05_SC_R]
connect_bd_intf_net [get_bd_intf_pins m05_nodes/M_SC_W] [get_bd_intf_pins m05_sc2axi/S_SC_W]
connect_bd_intf_net [get_bd_intf_pins m05_sc2axi/M_AXI] [get_bd_intf_pins m05_exit_pipeline/s_axi]
connect_bd_intf_net [get_bd_intf_pins s00_entry_pipeline/m_axi] [get_bd_intf_pins s00_axi2sc/S_AXI]
connect_bd_intf_net [get_bd_intf_pins s00_nodes/M_SC_AR] [get_bd_intf_pins switchboards/S00_SC_AR]
connect_bd_intf_net [get_bd_intf_pins s00_nodes/M_SC_AW] [get_bd_intf_pins switchboards/S00_SC_AW]
connect_bd_intf_net [get_bd_intf_pins s00_nodes/M_SC_B] [get_bd_intf_pins s00_axi2sc/S_SC_B]
connect_bd_intf_net [get_bd_intf_pins s00_nodes/M_SC_R] [get_bd_intf_pins s00_axi2sc/S_SC_R]
connect_bd_intf_net [get_bd_intf_pins s00_nodes/M_SC_W] [get_bd_intf_pins switchboards/S00_SC_W]
connect_bd_net -net aclk1_1 [get_bd_ports aclk1] [get_bd_pins clk_map/aclk1]
connect_bd_net -net aclk2_1 [get_bd_ports aclk2] [get_bd_pins clk_map/aclk2]
connect_bd_net -net aclk_net [get_bd_ports aclk] [get_bd_pins clk_map/aclk]
connect_bd_net [get_bd_ports aresetn] [get_bd_pins clk_map/aresetn]
# net aresetn_net has one end: clk_map/aresetn_out
connect_bd_net [get_bd_pins clk_map/M00_ACLK] \
  [get_bd_pins switchboards/m_sc_aclk] [get_bd_pins m00_sc2axi/aclk] [get_bd_pins m00_nodes/s_axi_aclk] \
  [get_bd_pins m00_nodes/m_axi_aclk] [get_bd_pins m00_exit_pipeline/aclk] [get_bd_pins m01_nodes/s_axi_aclk] \
  [get_bd_pins m02_nodes/s_axi_aclk] [get_bd_pins m03_nodes/s_axi_aclk] [get_bd_pins m04_nodes/s_axi_aclk] \
  [get_bd_pins m05_nodes/s_axi_aclk]
connect_bd_net [get_bd_pins clk_map/M00_ARESETN] \
  [get_bd_pins switchboards/m_sc_aresetn] [get_bd_pins m00_nodes/s_axi_aresetn] [get_bd_pins m00_nodes/m_axi_aresetn] \
  [get_bd_pins m00_exit_pipeline/aresetn] [get_bd_pins m01_nodes/s_axi_aresetn] [get_bd_pins m02_nodes/s_axi_aresetn] \
  [get_bd_pins m03_nodes/s_axi_aresetn] [get_bd_pins m04_nodes/s_axi_aresetn] [get_bd_pins m05_nodes/s_axi_aresetn]
connect_bd_net [get_bd_pins clk_map/M01_ACLK] [get_bd_pins m01_sc2axi/aclk] [get_bd_pins m01_nodes/m_axi_aclk] [get_bd_pins m01_exit_pipeline/aclk]
connect_bd_net [get_bd_pins clk_map/M02_ACLK] [get_bd_pins m02_sc2axi/aclk] [get_bd_pins m02_nodes/m_axi_aclk] [get_bd_pins m02_exit_pipeline/aclk]
connect_bd_net [get_bd_pins clk_map/M03_ACLK] [get_bd_pins m03_sc2axi/aclk] [get_bd_pins m03_nodes/m_axi_aclk] [get_bd_pins m03_exit_pipeline/aclk]
connect_bd_net [get_bd_pins clk_map/M04_ACLK] [get_bd_pins m04_sc2axi/aclk] [get_bd_pins m04_nodes/m_axi_aclk] [get_bd_pins m04_exit_pipeline/aclk]
connect_bd_net [get_bd_pins clk_map/M05_ACLK] [get_bd_pins m05_sc2axi/aclk] [get_bd_pins m05_nodes/m_axi_aclk] [get_bd_pins m05_exit_pipeline/aclk]
connect_bd_net [get_bd_pins clk_map/S00_ACLK] \
  [get_bd_pins switchboards/s_sc_aclk] [get_bd_pins s00_entry_pipeline/aclk] [get_bd_pins s00_axi2sc/aclk] \
  [get_bd_pins s00_nodes/s_sc_clk] [get_bd_pins s00_nodes/m_sc_clk]
connect_bd_net [get_bd_pins clk_map/S00_ARESETN] \
  [get_bd_pins switchboards/s_sc_aresetn] [get_bd_pins s00_entry_pipeline/aresetn] [get_bd_pins s00_nodes/s_sc_resetn] \
  [get_bd_pins s00_nodes/m_sc_resetn]
connect_bd_net -net m_axi_aresetn_1 [get_bd_pins clk_map/M01_ARESETN] [get_bd_pins m01_nodes/m_axi_aresetn] [get_bd_pins m01_exit_pipeline/aresetn]
connect_bd_net -net m_axi_aresetn_2 [get_bd_pins clk_map/M02_ARESETN] [get_bd_pins m02_nodes/m_axi_aresetn] [get_bd_pins m02_exit_pipeline/aresetn]
connect_bd_net -net m_axi_aresetn_3 [get_bd_pins clk_map/M03_ARESETN] [get_bd_pins m03_nodes/m_axi_aresetn] [get_bd_pins m03_exit_pipeline/aresetn]
connect_bd_net -net m_axi_aresetn_4 [get_bd_pins clk_map/M04_ARESETN] [get_bd_pins m04_nodes/m_axi_aresetn] [get_bd_pins m04_exit_pipeline/aresetn]
connect_bd_net -net m_axi_aresetn_5 [get_bd_pins clk_map/M05_ARESETN] [get_bd_pins m05_nodes/m_axi_aresetn] [get_bd_pins m05_exit_pipeline/aresetn]
# net swbd_aclk_net has one end: clk_map/swbd_aclk
# net swbd_aresetn_net has one end: clk_map/swbd_aresetn

validate_bd_design
save_bd_design
